# EAGLE design i-uC-IO-extention (EAGLE 5.07)
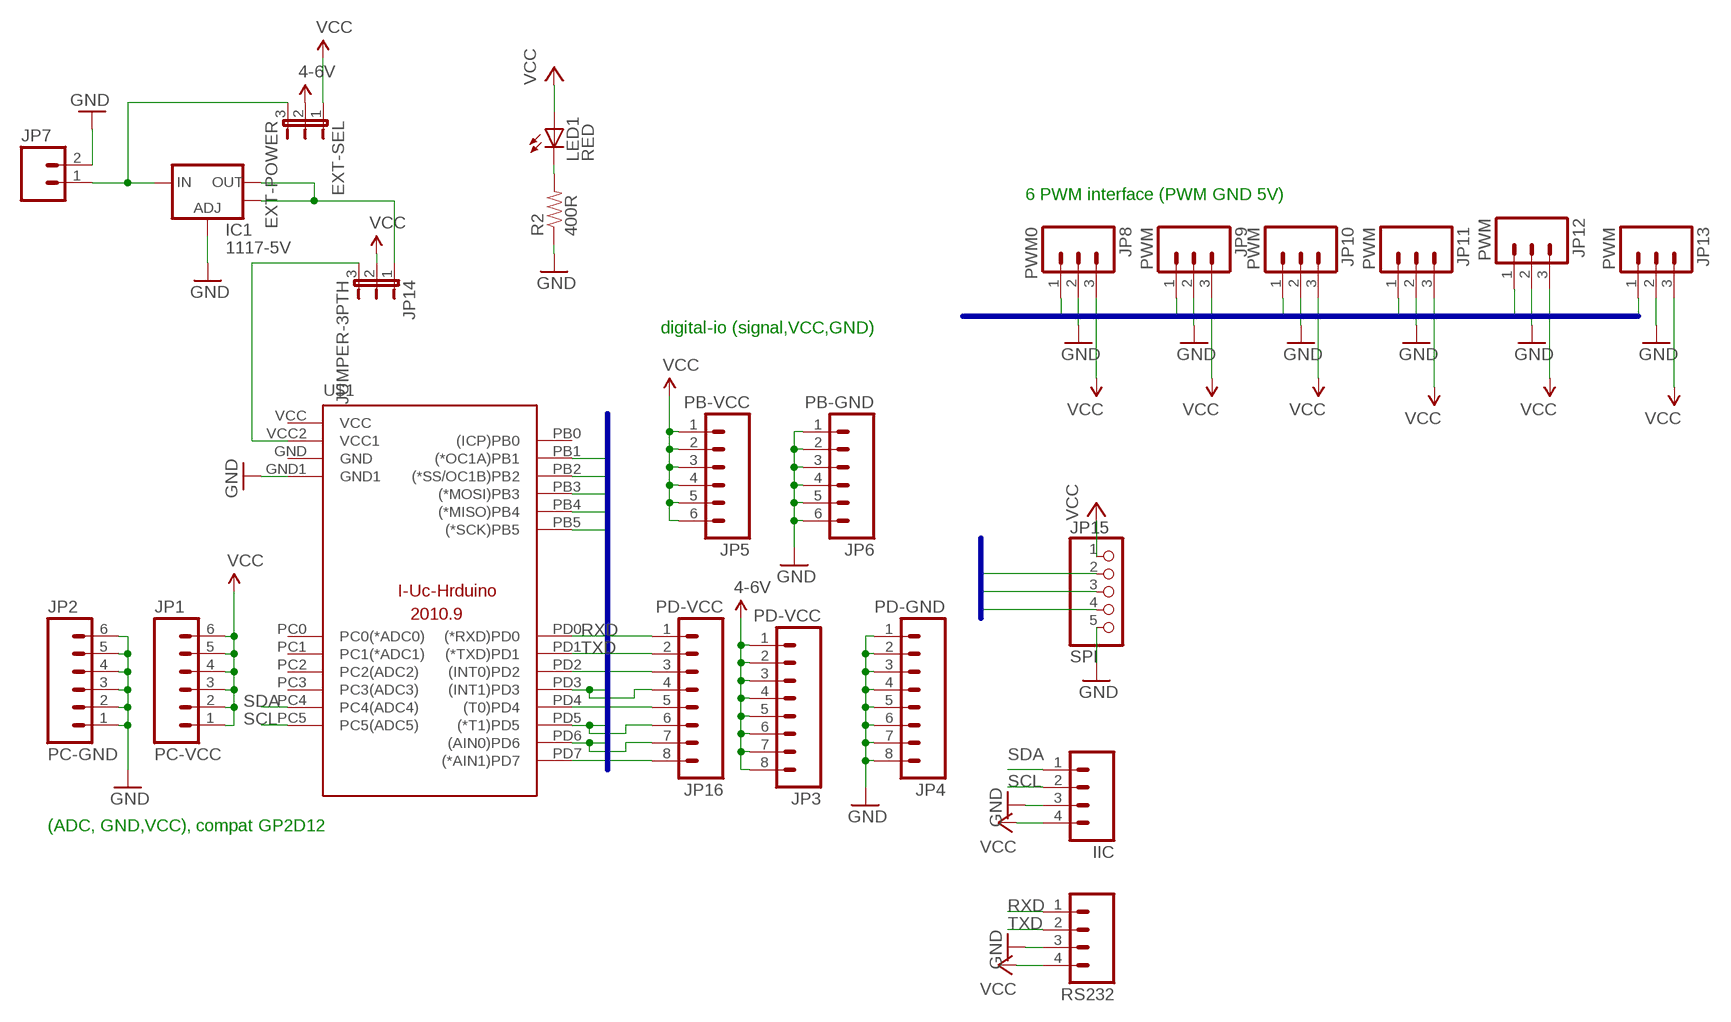
[diagram p0: schematic, sheet 1]

## Parts
EXT-SEL  EXT-POWER  JUMPER-3PTH  [1X03]
IC1  1117-5V  V_REG_LM1117SOT223  [SOT223]
IIC  M04LOCK  [1X04_LOCK]
JP1  PC-VCC  M06LOCK  [1X06_LOCK]
JP2  PC-GND  M06LOCK  [1X06_LOCK]
JP3  PD-VCC  M08  [1X08]
JP4  PD-GND  M08LOCK  [1X08_LOCK]
JP5  PB-VCC  M06LOCK  [1X06_LOCK]
JP6  PB-GND  M06LOCK  [1X06_LOCK]
JP7  M025MM  [SCREWTERMINAL-5MM-2]
JP8  PWM0  M03LOCK  [1X03_LOCK]
JP9  PWM  M03LOCK  [1X03_LOCK]
JP10  PWM  M03LOCK  [1X03_LOCK]
JP11  PWM  M03LOCK  [1X03_LOCK]
JP12  PWM  M03LOCK  [1X03_LOCK]
JP13  PWM  M03LOCK  [1X03_LOCK]
JP14  JUMPER-3PTH  [1X03]
JP15  SPI  PINHD-1X5  [1X05]
JP16  PD-VCC  M08  [1X08]
LED1  RED  LEDCHIP-LED0805  [CHIP-LED0805]
R2  400R  RESISTOR0805  [0805]
RS232  M04LOCK  [1X04_LOCK]
U$1  I-UC-V0/EXT-V0  [I-UC-V0-EXT-V0]

## Nets
4-6V: EXT-SEL.2 JP3.1 JP3.2 JP3.3 JP3.4 JP3.5 JP3.6 JP3.7 JP3.8
GND: IC1.1(ADJ) IIC.3 JP2.1 JP2.2 JP2.3 JP2.4 JP2.5 JP2.6 JP4.1 JP4.2 JP4.3 JP4.4 JP4.5 JP4.6 JP4.7 JP4.8 JP6.1 JP6.2 JP6.3 JP6.4 JP6.5 JP6.6 JP7.2 JP8.2 JP9.2 JP10.2 JP11.2 JP12.2 JP13.2 JP15.5 R2.1 RS232.3 U$1.GND1
N$1: EXT-SEL.3 IC1.3(IN) JP7.1
N$2: IC1.2(OUT) IC1.4(OUT) JP14.1
N$5: JP14.3 U$1.VCC2(VCC1)
N$6: JP16.3 U$1.PD2((INT0)PD2)
N$7: LED1.C R2.2
N$8: JP16.5 U$1.PD4((T0)PD4)
N$11: JP16.8 U$1.PD7((*AIN1)PD7)
PB1: JP8.1 U$1.PB1((*OC1A)PB1)
PB2: JP9.1 U$1.PB2((*SS/OC1B)PB2)
PB3: JP10.1 JP15.2 U$1.PB3((*MOSI)PB3)
PB4: JP15.3 U$1.PB4((*MISO)PB4)
PB5: JP15.4 U$1.PB5((*SCK)PB5)
PD3: JP11.1 JP16.4 U$1.PD3((INT1)PD3)
PD5: JP12.1 JP16.6 U$1.PD5((*T1)PD5)
PD6: JP13.1 JP16.7 U$1.PD6((AIN0)PD6)
RXD: JP16.1 RS232.1 U$1.PD0((*RXD)PD0)
SCL: IIC.2 U$1.PC5(PC5(ADC5))
SDA: IIC.1 U$1.PC4(PC4(ADC4))
TXD: JP16.2 RS232.2 U$1.PD1((*TXD)PD1)
VCC: EXT-SEL.1 IIC.4 JP1.1 JP1.2 JP1.3 JP1.4 JP1.5 JP1.6 JP5.1 JP5.2 JP5.3 JP5.4 JP5.5 JP5.6 JP8.3 JP9.3 JP10.3 JP11.3 JP12.3 JP13.3 JP14.2 JP15.1 LED1.A RS232.4
Unconnected: U$1.GND U$1.PB0((ICP)PB0) U$1.PC0(PC0(*ADC0)) U$1.PC1(PC1(*ADC1)) U$1.PC2(PC2(ADC2)) U$1.PC3(PC3(ADC3)) U$1.VCC

## Buses
B$1
B$2
B$3

## Notes on the sheet
- 6 PWM interface (PWM GND 5V)
- digital-io (signal,VCC,GND)
- (ADC, GND,VCC), compat GP2D12

## Library data of the parts
EXT-SEL JP14 = SparkFun:JUMPER-3
IC1 = SparkFun:V_REG_LM1117: Voltage Regulator LM1117 Standard adjustable voltage regulator but in SMD form. Spark Fun Electronics SKU : COM-00595
IIC RS232 = SparkFun:M04: Header 4 Standard 4-pin 0.1" header. Use with straight break away headers (SKU : PRT-00116), right angle break away headers (PRT-00553), swiss pins (PRT-00743), machine pins (PRT-00117), and female headers (PRT-00115). Molex polarized connector foot print use with SKU : PRT-08231 with associated crimp pins and housings.
JP1 JP2 JP5 JP6 = SparkFun:M06: Header 6 Standard 6-pin 0.1" header. Use with straight break away headers (SKU : PRT-00116), right angle break away headers (PRT-00553), swiss pins (PRT-00743), machine pins (PRT-00117), and female headers (PRT-00115). Molex polarized connector foot print use with SKU : PRT-08094 with associated crimp pins and housings. NOTES ON THE VARIANTS LOCK and LOCK_LONGPADS... This footprint was designed to help hold the alignment of a through-hole component (i.e. 6-pin header) while soldering it into place. You may notice that each hole has been shifted either up or down by 0.005 of an inch from it's more standard position (which is a perfectly straight line). This slight alteration caused the pins (the squares in the middle) to touch the edges of the holes. Because they are alternating, it causes a "brace" to hold the component in place. 0.005 has proven to be the perfect amount of "off-center" position when using our standard breakaway headers. Although looks a little odd when you look at the bare footprint, once you have a header in there, the alteration is very hard to notice. Also, if you push a header all the way into place, it is covered up entirely on the bottom side. This idea of altering the position of holes to aid alignment will be further integrated into the Sparkfun Library for other footprints. It can help hold any component with 3 or more connection pins.
JP3 JP4 JP16 = SparkFun:M08: Header 8 Standard 8-pin 0.1" header. Use with straight break away headers (SKU : PRT-00116), right angle break away headers (PRT-00553), swiss pins (PRT-00743), machine pins (PRT-00117), and female headers (PRT-00115).
JP7 = SparkFun:M02: Header 2 Standard 2-pin 0.1" header. Use with straight break away headers (SKU : PRT-00116), right angle break away headers (PRT-00553), swiss pins (PRT-00743), machine pins (PRT-00117), and female headers (PRT-00115). Molex polarized connector foot print use with SKU : PRT-08233 with associated crimp pins and housings.
JP8-JP13 = SparkFun:M03: Header 3 Standard 3-pin 0.1" header. Use with straight break away headers (SKU : PRT-00116), right angle break away headers (PRT-00553), swiss pins (PRT-00743), machine pins (PRT-00117), and female headers (PRT-00115). Molex polarized connector foot print use with SKU : PRT-08232 with associated crimp pins and housings.
JP15 = pinhead:PINHD-1X5: PIN HEADER
LED1 = led:LED: LED OSRAM: - CHIPLED LG R971, LG N971, LY N971, LG Q971, LY Q971, LO R971, LY R971 LH N974, LH R974 LS Q976, LO Q976, LY Q976 LO Q996 - Hyper CHIPLED LW Q18S LB Q993, LB Q99A, LB R99A - SideLED LS A670, LO A670, LY A670, LG A670, LP A670 LB A673, LV A673, LT A673, LW A673 LH A674 LY A675 LS A676, LA A676, LO A676, LY A676, LW A676 LS A679, LY A679, LG A679 - Hyper Micro SIDELED® LS Y876, LA Y876, LO Y876, LY Y876 LT Y87S - SmartLED LW L88C, LW L88S LB L89C, LB L89S, LG L890 LS L89K, LO L89K, LY L89K LS L896, LA L896, LO L896, LY L896 - TOPLED LS T670, LO T670, LY T670, LG T670, LP T670 LSG T670, LSP T670, LSY T670, LOP T670, LYG T670 LG T671, LOG T671, LSG T671 LB T673, LV T673, LT T673, LW T673 LH T674 LS T676, LA T676, LO T676, LY T676, LB T676, LH T676, LSB T676, LW T676 LB T67C, LV T67C, LT T67C, LS T67K, LO T67K, LY T67K, LW E67C LS E67B, LA E67B, LO E67B, LY E67B, LB E67C, LV E67C, LT E67C LW T67C LS T679, LY T679, LG T679 LS T770, LO T770, LY T770, LG T770, LP T770 LB T773, LV T773, LT T773, LW T773 LH T774 LS E675, LA E675, LY E675, LS T675 LS T776, LA T776, LO T776, LY T776, LB T776 LHGB T686 LT T68C, LB T68C - Hyper Mini TOPLED® LB M676 - Mini TOPLED Santana® LG M470 LS M47K, LO M47K, LY M47K Source: http://www.osram.convergy.de LUXEON: - LUMILED® LXK2-PW12-R00, LXK2-PW12-S00, LXK2-PW14-U00, LXK2-PW14-V00 LXK2-PM12-R00, LXK2-PM12-S00, LXK2-PM14-U00 LXK2-PE12-Q00, LXK2-PE12-R00, LXK2-PE12-S00, LXK2-PE14-T00, LXK2-PE14-U00 LXK2-PB12-K00, LXK2-PB12-L00, LXK2-PB12-M00, LXK2-PB14-N00, LXK2-PB14-P00, LXK2-PB14-Q00 LXK2-PR12-L00, LXK2-PR12-M00, LXK2-PR14-Q00, LXK2-PR14-R00 LXK2-PD12-Q00, LXK2-PD12-R00, LXK2-PD12-S00 LXK2-PH12-R00, LXK2-PH12-S00 LXK2-PL12-P00, LXK2-PL12-Q00, LXK2-PL12-R00 Source: www.luxeon.com KINGBRIGHT: KA-3528ASYC Source: www.kingbright.com
R2 = digital-toy:RESISTOR: Resistor Basic schematic elements and footprints for 0603, 1206, and PTH 1/10th watt (small) resistors. digital-toy copy vertical mount of axial-0.3 from rcl.lbr : the 0207/xx
U$1 = digital-toy:I-UC-V0

## Board
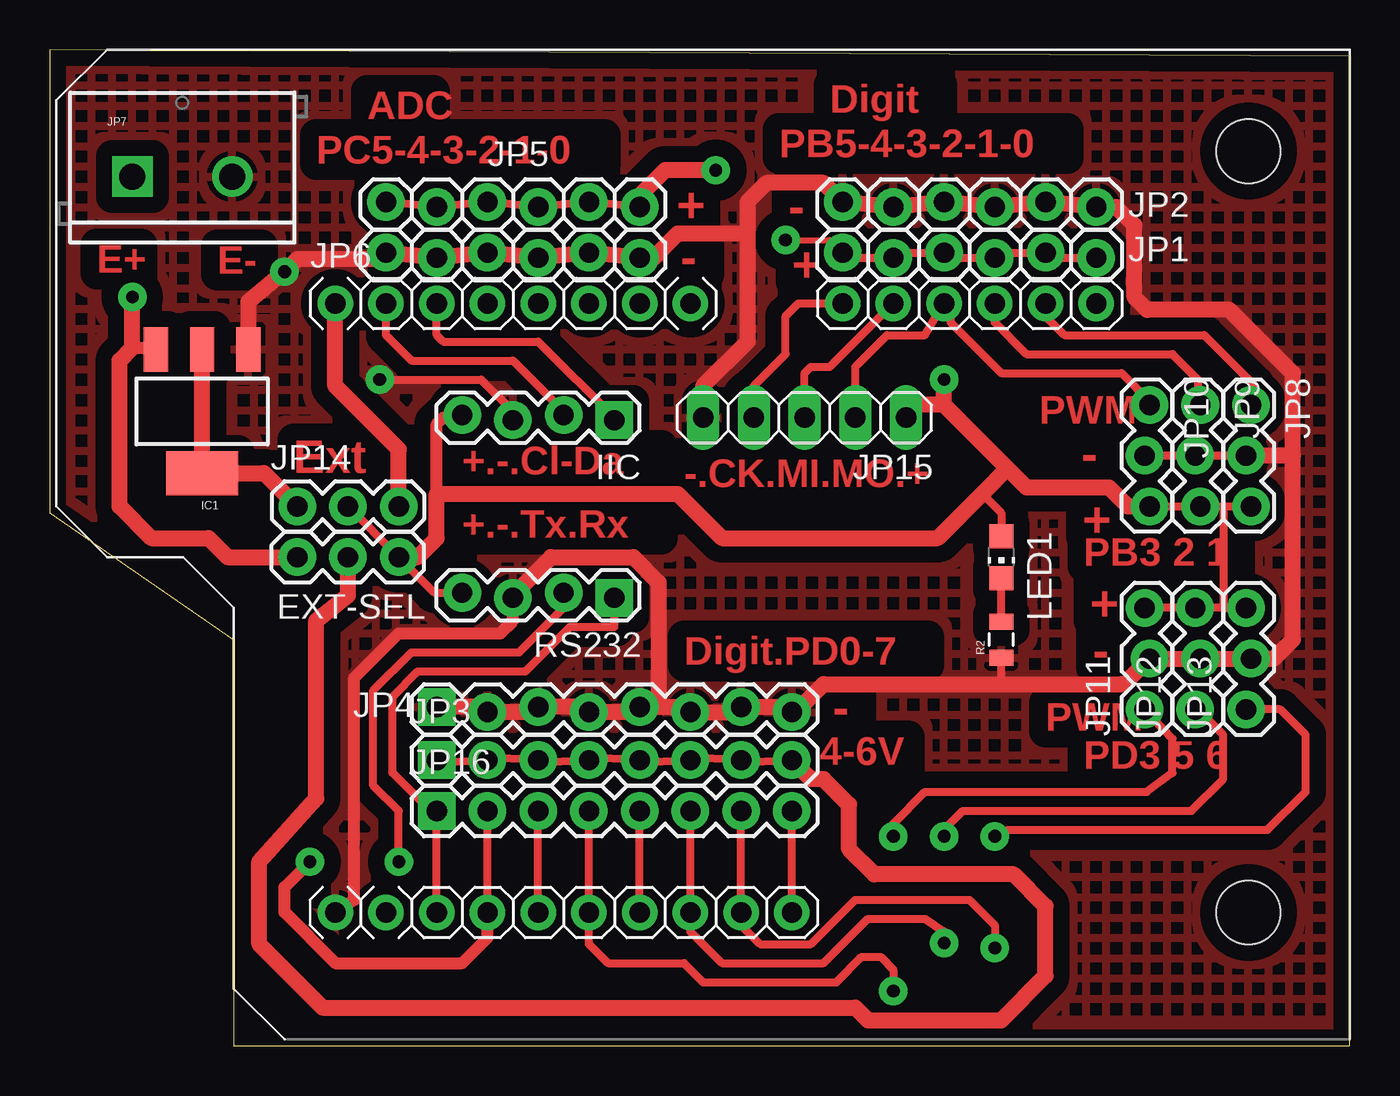
[diagram p1: board, top side]
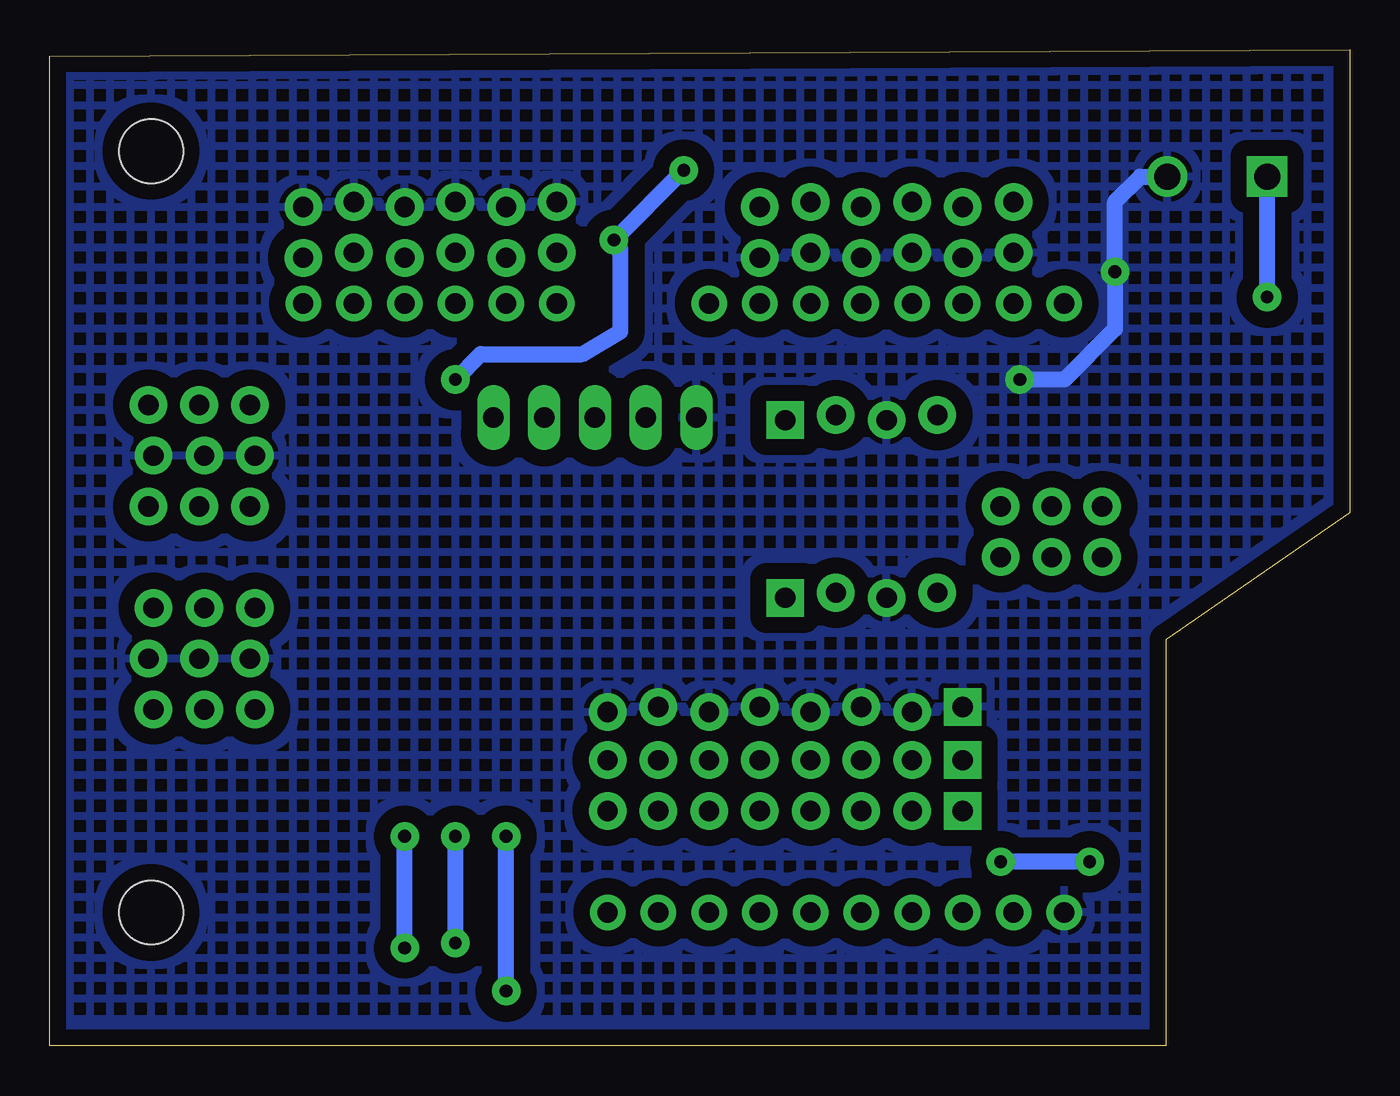
[diagram p2: board, bottom side, seen from below]

Size 65.07 x 49.84 mm. Coordinates in mm from the lower left corner, seen from the top.
Outline: 9.21,0 65.07,0 65.07,49.52 0,49.83 0,26.67 9.21,20.32 9.21,0
Copper layers (1*16): Top 0.035mm / dielectric 1.5mm / Bottom 0.035mm
Design rules "SparkFun-HP1007-600x600dpi": minimum track width 10mil, minimum drill 20mil, track to track 12mil, track to pad 12mil, pad to pad 12mil, via to via 12mil, smd to smd 12mil, copper to edge 12mil, drill to drill 12mil, minimum pad ring 12mil, minimum via ring 10mil, stop-mask expansion 4mil, vias tented up to drill 25mil, thermal gap 10mil

### Footprints (pad centres in the part's own frame; a part is rotated, then mirrored left to right if it is on the bottom)
1X03 = drill 1.016 pad 1.88 round: 1 0,0; 2 2.54,0; 3 5.08,0
SOT223 = smd 1.219 x 2.235: 1 -2.311,-3.099; 2 0,-3.099; 3 2.311,-3.099 | smd 3.6 x 2.2: 4 0,3.099
1X04_LOCK = drill 1.016 pad 1.88 square: 1 0,0.127 | drill 1.016 pad 1.88 round: 2 2.54,-0.127; 3 5.08,0.127; 4 7.62,-0.127
1X06_LOCK = drill 1.016 pad 1.88 round: 1 0,0; 2 2.54,-0.254; 3 5.08,0; 4 7.62,-0.254; 5 10.16,0; 6 12.7,-0.254
1X08 = drill 1.016 pad 1.88 square: 1 0,0 | drill 1.016 pad 1.88 round: 2 2.54,0; 3 5.08,0; 4 7.62,0; 5 10.16,0; 6 12.7,0; 7 15.24,0; 8 17.78,0
1X08_LOCK = drill 1.016 pad 1.88 square: 1 0,0.127 | drill 1.016 pad 1.88 round: 2 2.54,-0.127; 3 5.08,0.127; 4 7.62,-0.127; 5 10.16,0.127; 6 12.7,-0.127; 7 15.24,0.127; 8 17.78,-0.127
SCREWTERMINAL-5MM-2 = drill 1.3 pad 2.032 square: 1 0,0 | drill 1.3 pad 2.032 round: 2 5,0
1X03_LOCK = drill 1.016 pad 1.88 round: 1 0,0.127; 2 2.54,-0.127; 3 5.08,0.127
1X05 = drill 1.016 long: 1 -5.08,0; 2 -2.54,0; 3 0,0; 4 2.54,0; 5 5.08,0
CHIP-LED0805 = smd 1.2 x 1.2: A 0,-1.05; C 0,1.05
0805 = smd 0.8 x 1.2: 1 -0.9,0; 2 0.9,0
I-UC-V0-EXT-V0 = drill 1.016 pad 1.778 round: GND 48.26,36.83; GND1 30.48,6.35; PB0 68.58,36.83; PB1 66.04,36.83; PB2 63.5,36.83; PB3 60.96,36.83; PB4 58.42,36.83; PB5 55.88,36.83; PC0 45.72,36.83; PC1 43.18,36.83; PC2 40.64,36.83; PC3 38.1,36.83; PC4 35.56,36.83; PC5 33.02,36.83; PD0 35.56,6.35; PD1 38.1,6.35; PD2 40.64,6.35; PD3 43.18,6.35; PD4 45.72,6.35; PD5 48.26,6.35; PD6 50.8,6.35; PD7 53.34,6.35; VCC 33.02,6.35; VCC2 30.48,36.83 | hole 3.2: 76.2,44.45; 76.2,6.35

### Placement (x,y rotation side)
EXT-SEL  17.46,24.45 180 top
IC1  7.62,31.75 180 top
IIC  28.26,31.43 180 top
JP1  39.69,39.69 0 top
JP2  39.69,42.23 0 top
JP3  19.37,14.29 0 top
JP4  19.37,16.83 0 top
JP5  16.83,42.23 0 top
JP6  16.83,39.69 0 top
JP7  4.13,43.5 0 top
JP8  60.01,32.07 270 top
JP9  57.47,32.07 270 top
JP10  54.93,32.07 270 top
JP11  54.93,16.83 90 top
JP12  57.47,16.83 90 top
JP13  60.01,16.83 90 top
JP14  12.38,26.99 0 top
JP15  37.78,31.43 180 top
JP16  19.37,11.75 0 top
LED1  47.62,24.45 180 top
R2  47.62,20.32 90 top
RS232  28.26,22.54 180 top
U$1  -16.19,0.32 0 top

### Tracks (layer width: path | path; a pad name or v marks a point on that pad's centre or on a via)
4-6V
  Top 0.406: JP3.8 34.86,14.16 JP3.7 32.32,14.41 JP3.6 29.78,14.16 JP3.5 27.24,14.41 JP3.4 24.7,14.16 JP3.3 22.16,14.41 JP3.2 19.62,14.16 JP3.1
  Top 0.813: EXT-SEL.2 14.92,22.54 13.33,21.27 13.33,12.38 10.48,9.21 10.48,5.08 13.65,1.9 40.32,1.9 40.96,1.27 47.63,1.27 49.85,3.49 49.85,6.99 48.26,8.57 41.28,8.57 40,9.84 40,12.07 38.74,13.34 38.1,13.34 JP3.8
GND  (via drill 0.64 pad 1.42)
  Top 0.305: JP4.8 37.34,16.7 | 53.98,18.42 54.1,18.42 | RS232.3 23.18,21.91
  Top 0.406: JP8.2 JP9.2 JP10.2 | JP4.3 24.19,16.7 | JP4.4 26.73,16.95 | JP4.5 29.27,16.7 | IIC.3 23.18,31.75 21.59,33.34 v16.51,33.34 | 53.66,18.1 53.98,18.42 | RS232.3 23.18,22.54 | 47.63,18.1 R2.1
  Top 0.61: 11.91,38.89 v11.75,38.73 | U$1.GND1 15.24,7.3 15.24,18.42 17.46,20.64 22.54,20.64 23.18,21.27 RS232.3
  Top 0.813: JP4.1 21.65,16.95 JP4.2 24.19,16.7 | 26.73,16.95 JP4.3 | 29.27,16.7 JP4.4 | 30.48,16.95 JP4.5 | 30.48,16.95 31.81,16.95 JP4.6 34.35,16.7 JP4.7 36.89,16.95 JP4.8 | JP15.5 32.7,33.02 34.92,35.24 34.92,40.64 | 34.92,40.64 34.92,42.23 35.88,43.18 38.74,43.18 JP2.1 JP2.2 JP2.3 JP2.4 JP2.5 JP2.6 53.4,41.97 54.29,41.08 54.29,37.47 54.93,36.83 59.06,36.83 62.23,33.65 62.23,29.53 | 34.92,40.64 31.43,40.64 30.23,39.43 JP6.6 JP6.5 JP6.4 JP6.3 JP6.2 JP6.1 16.51,39.37 12.38,39.37 11.91,38.89 9.93,37.24 IC1.1 | 62.23,29.53 62.23,20.32 61.28,19.37 JP13.2 JP12.2 JP11.2 54.1,18.42 | 62.23,29.53 JP8.2 | 37.34,16.7 38.74,18.1 47.63,18.1 53.66,18.1 | 23.18,22.54 25.08,24.45 29.21,24.45 30.48,23.18 30.48,16.95
  Bottom 0.813: JP7.2 10.48,43.5 11.75,42.23 v11.75,38.73 11.75,35.88 14.29,33.34 v16.51,33.34
  pour Top (isolate 0.813, hatched): -5.08,63.82 78.11,53.34 82.23,42.86 82.23,-0.95 63.82,-19.37 -6.35,-19.37 -29.84,4.13 -28.26,5.4
  pour Bottom (isolate 0.813, hatched): -0.63,53.02 65.09,53.02 70.8,46.04 70.8,1.59 61.28,-6.67 4.76,-6.67 -6.98,5.08 -6.98,46.67
N$1  (via drill 0.64 pad 1.42)
  Top 0.406: 4.93,34.93 IC1.3
  Top 0.61: 4.13,34.93 4.93,34.93
  Top 0.813: v4.13,37.47 4.13,34.93 3.49,34.29 3.49,26.99 5.08,25.4 7.94,25.4 8.89,24.45 EXT-SEL.3
  Bottom 0.813: v4.13,37.47 JP7.1
N$2
  Top 0.813: IC1.2 IC1.4 10.72,28.65 JP14.1
N$5
  Top 0.813: JP14.3 17.46,29.84 14.29,33.02 U$1.VCC2
N$6
  Top 0.406: U$1.PD2 JP16.3
N$7
  Top 0.406: R2.2 LED1.C
N$8
  Top 0.406: U$1.PD4 JP16.5
N$11
  Top 0.406: U$1.PD7 JP16.8
PB1
  Top 0.305: 49.85,36.51 U$1.PB1
  Top 0.406: 49.85,36.51 50.8,35.56 57.79,35.56 60.32,33.02 60.32,32.26 JP8.1
PB2
  Top 0.305: 47.31,36.19 U$1.PB2 | 57.47,32.19 JP9.1
  Top 0.406: 47.31,36.19 48.9,34.61 56.2,34.61 57.47,33.34 57.47,32.19
PB3
  Top 0.406: JP10.1 55.05,32.26 53.66,33.65 47.63,33.65 45.09,36.19 45.09,36.83 U$1.PB3 43.82,35.56 41.91,35.56 40.32,33.97 JP15.2
PB4
  Top 0.406: U$1.PB4 39.05,33.97 38.1,33.97 37.78,33.65 JP15.3
PB5
  Top 0.406: JP15.4 35.24,33.02 36.83,34.61 36.83,36.51 37.46,37.15 U$1.PB5
PD3  (via drill 0.64 pad 1.42)
  Top 0.406: JP16.4 U$1.PD3 26.99,5.08 27.94,4.13 31.75,4.13 32.7,3.17 39.37,3.17 40.64,4.45 41.59,4.45 42.23,3.81 v42.23,2.73 | v42.23,10.48 42.23,11.11 43.82,12.7 54.93,12.7 56.2,13.65 56.2,15.37 JP11.1
  Bottom 0.813: v42.23,2.73 v42.23,10.48
PD5  (via drill 0.64 pad 1.42)
  Top 0.406: JP16.6 U$1.PD5 32.07,5.71 33.65,4.13 38.74,4.13 40.96,6.35 43.82,6.35 44.77,5.71 v44.77,5.14 | v44.77,10.48 44.77,10.79 45.72,11.75 57.15,11.75 58.74,13.34 58.74,15.56 57.47,16.83 JP12.1
  Bottom 0.813: v44.77,5.14 v44.77,10.48
PD6  (via drill 0.64 pad 1.42)
  Top 0.406: JP16.7 U$1.PD6 34.61,6.03 35.56,5.08 38.1,5.08 40.32,7.3 46.04,7.3 47.31,6.03 v47.31,4.89 | v47.31,10.48 47.94,10.79 60.96,10.79 62.87,12.7 62.87,15.56 61.59,16.83 JP13.1
  Bottom 0.813: v47.31,4.89 v47.31,10.48
RXD
  Top 0.305: JP16.1 19.05,11.75
  Top 0.406: U$1.PD0 JP16.1 | 19.05,11.75 17.14,13.65 17.14,17.46 18.42,18.73 23.81,18.73 26.03,20.95 28.26,20.95 28.26,21.27 RS232.1
SCL
  Top 0.406: U$1.PC5 16.83,35.56 18.1,34.29 23.18,34.29 25.72,31.75 IIC.2
SDA
  Top 0.406: U$1.PC4 19.37,35.56 19.68,35.24 24.45,35.24 28.26,31.43 IIC.1
TXD  (via drill 0.64 pad 1.42)
  Top 0.406: U$1.PD1 JP16.2 | RS232.2 25.72,21.91 23.5,19.68 18.1,19.68 16.19,17.78 16.19,13.02 17.46,11.75 v17.46,9.21
  Top 0.61: U$1.PD1 21.91,5.4 20.64,4.13 14.29,4.13 11.75,6.67 11.75,7.94 v13.02,9.21
  Bottom 0.813: v13.02,9.21 v17.46,9.21
VCC  (via drill 0.64 pad 1.42)
  Top 0.305: 45.02,39.43 44.51,39.43 | v36.83,40.32 39.05,40.32 JP1.1
  Top 0.406: 52.64,39.69 JP1.6 50.1,39.43 JP1.5 47.56,39.69 JP1.4 45.02,39.43 JP1.3 42.48,39.69 JP1.2 39.94,39.43 JP1.1 | JP5.1 JP5.2 JP5.3 JP5.4 JP5.5 JP5.6 | JP10.3 JP9.3 58.74,26.99 | 58.74,26.99 JP8.3 | 58.74,21.91 JP12.3 JP11.3 | 58.74,21.91 JP13.3 | JP14.2 EXT-SEL.1 19.24,22.67 RS232.4 | 58.74,26.99 58.74,21.91 | LED1.A 47.63,26.67 46.67,27.62
  Top 0.61: 19.37,27.62 19.37,31.11 19.68,31.43 20.51,31.43 IIC.4
  Top 0.813: JP10.3 53.98,26.99 53.02,27.94 48.9,27.94 47.94,28.89 | JP5.6 29.53,42.54 30.8,43.82 v33.34,43.82 | JP15.1 43.5,32.07 44.77,32.07 | 47.94,28.89 44.77,32.07 | 44.77,32.07 v44.77,33.34 | EXT-SEL.1 18.42,24.45 19.37,25.4 19.37,27.62 31.43,27.62 33.65,25.4 44.45,25.4 46.67,27.62 47.94,28.89
  Bottom 0.813: v33.34,43.82 v36.83,40.32 36.51,39.88 36.51,35.75 38.42,34.61 43.5,34.61 v44.77,33.34

### Text on the board
Top: ADC | Digit | PC5-4-3-2-1-0 | PB5-4-3-2-1-0 | + | - | E+ | E- | - | + | PWM | Ext | +.-.Cl-Da | -.CK.MI.MO.+ | - | +.-.Tx.Rx | + | PB3 2 1 | + | Digit.PD0-7 | - | - | PWM | 4-6V | PD3 5 6